# Altium schematic sheet Controller_Board_Interface.SchDoc: Title
size B; Organization: Midnight Sun Solar Rayce Car Team; Address1: University of Waterloo; Address2: 200 University Ave W; Address3: Waterloo, ON, Canada; Address4: N2L 3E9; Website: www.uwmidsun.com; ProjectName: ProjectName
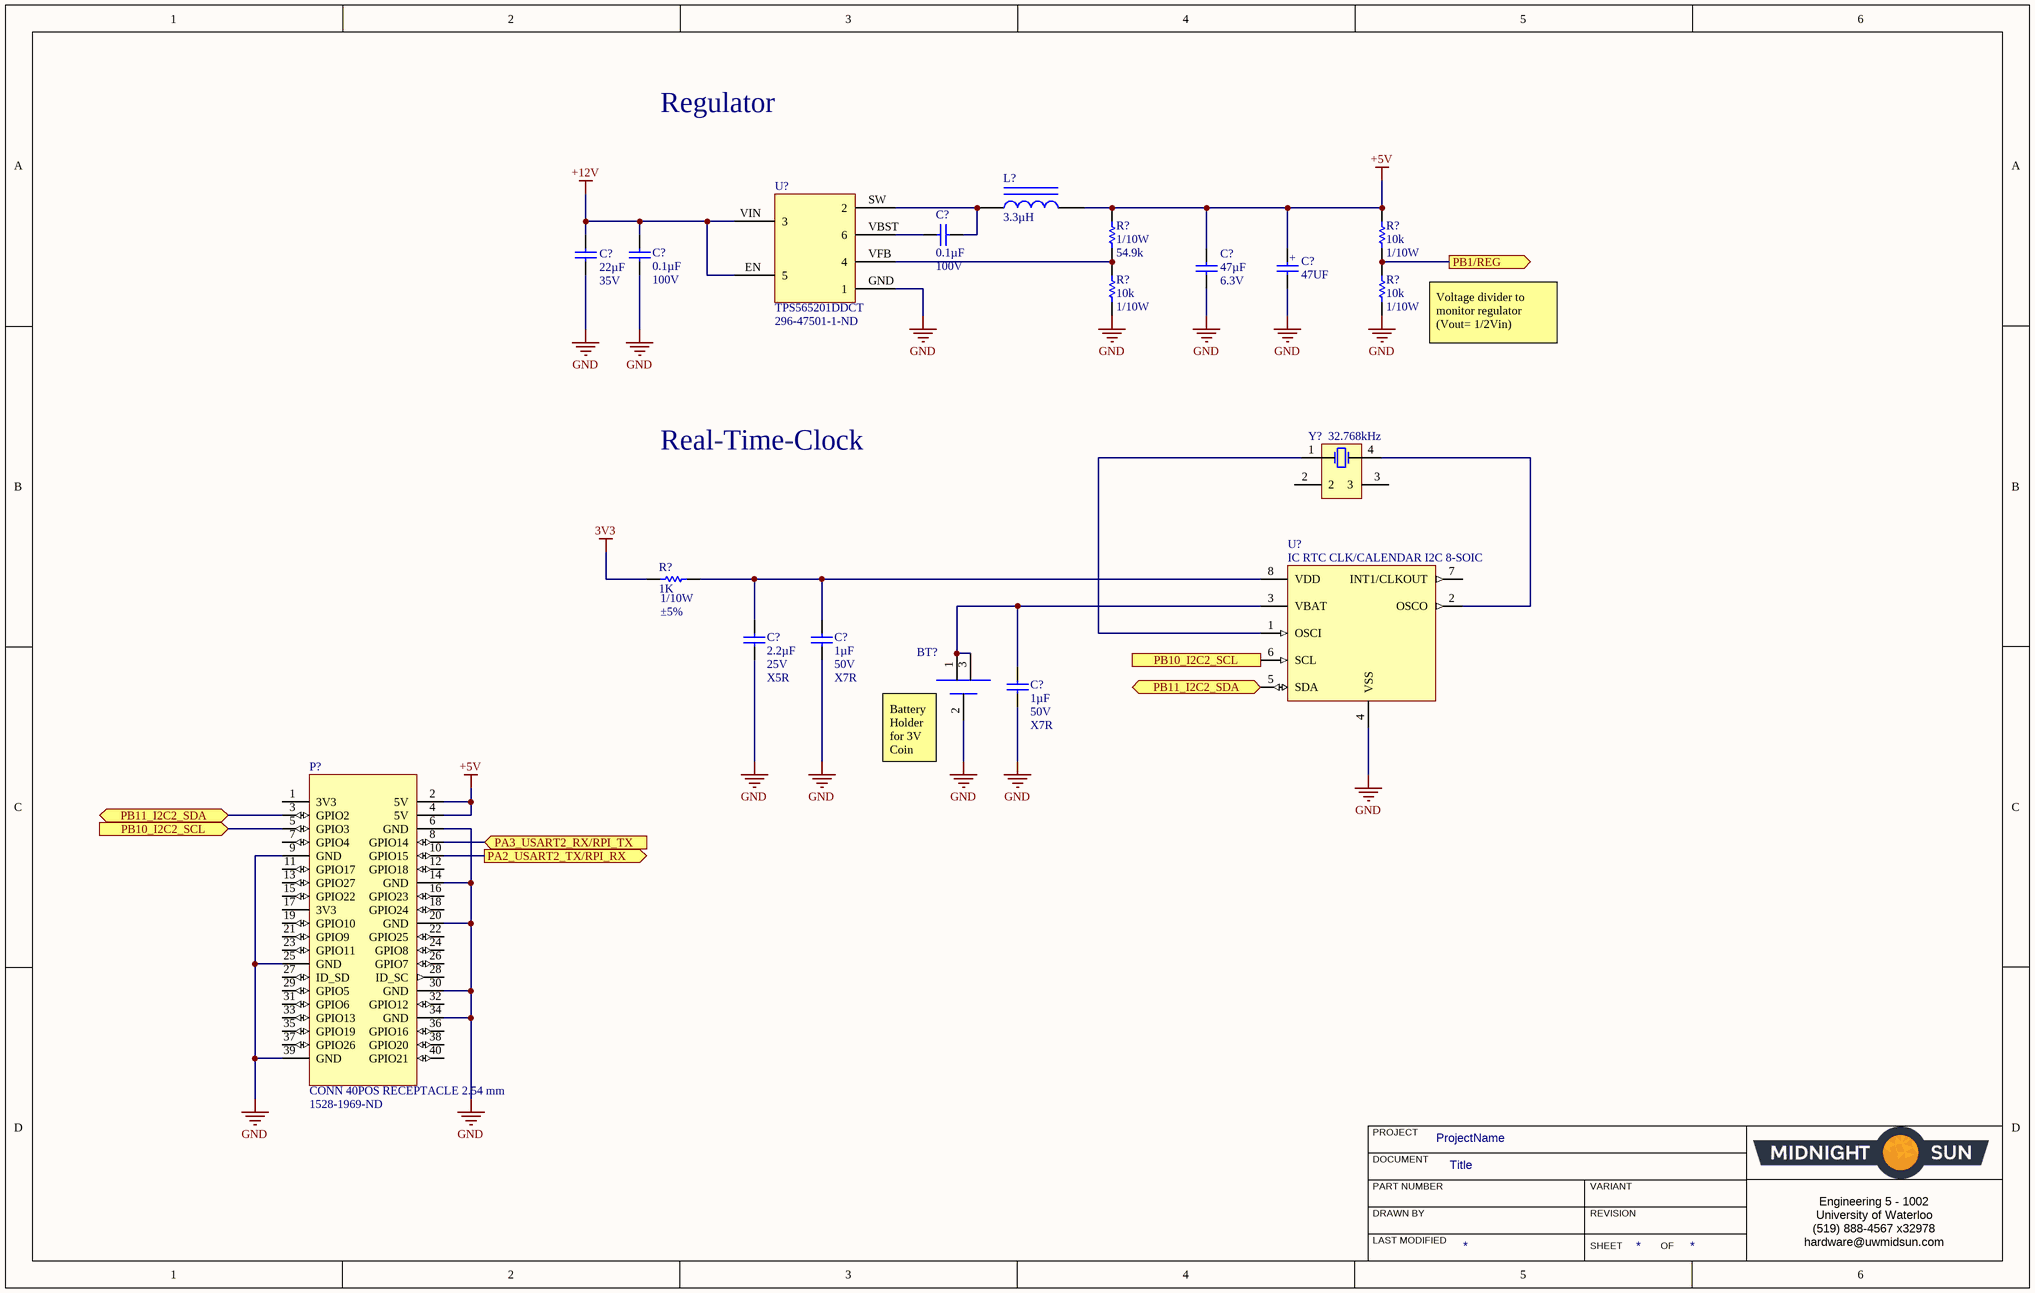
[diagram p0: Controller_Board_Interface.SchDoc]

## Parts
(Parts that share a designator on the sheet are numbered #1, #2 ... from top to bottom, then left to right.)
BT?  HOLDER BATTERY COIN 12MM DIA  [HOLDER COIN CELL 1220 3V]  (value not drawn)
C?#1  CAP CER 22UF 35V X5R 0805  [CAP, 0805]  (value not drawn)
C?#2  Capacitance: 0.1µF  Voltage: 100V  [CAP, 0805]  (hidden comment: CAP CER 0.1UF 100V 10% X7R 0805)
C?#3  Capacitance: 0.1µF  Voltage: 100V  [CAP, 0805]  (hidden comment: CAP CER 0.1UF 100V 10% X7R 0805)
C?#4  CAP CER 47UF 6.3V X7R 1210  [1210]  (value not drawn)
C?#5  47UF  [CAP ALUM 6.3MM RADIAL SMD]
C?#6  Capacitance: 2.2µF  Voltage: 25V  Temperature Coefficient: X5R  [CAP, 0603]  (hidden comment: CAP CER 2.2UF 25V 10% X5R 0603)
C?#7  Capacitance: 1µF  Voltage: 50V  Temperature Coefficient: X7R  [CAP, 0603]  (hidden comment: CAP CER 1UF 50V 10% X7R 0603)
C?#8  Capacitance: 1µF  Voltage: 50V  Temperature Coefficient: X7R  [CAP, 0603]  (hidden comment: CAP CER 1UF 50V 10% X7R 0603)
L?  Inductance: 3.3µH  [IND 3.3UH 5.2A 20 MOHM SMD VLP8040]  (hidden comment: IND 3.3uH 5.2A 20MOHM SMD)
P?  CONN 40POS RECEPTACLE 2.54 mm  Supplier Part Number 1: 1528-1969-ND  [CONN 40POS RECEPTACLE 2.54 MM]
R?#1  Power (Watts): 1/10W  Resistance (Ohms): 54.9k  [RES, 0603]  (hidden comment: RES 54.9K OHM 1% 1/10W 0603)
R?#2  Resistance: 10k  Power: 1/10W  [RES, 0603]  (hidden comment: RES 10K OHM 1% 1/10W 0603)
R?#3  Resistance: 10k  Power: 1/10W  [RES, 0603]  (hidden comment: RES 10K OHM 1% 1/10W 0603)
R?#4  Resistance: 10k  Power: 1/10W  [RES, 0603]  (hidden comment: RES 10K OHM 1% 1/10W 0603)
R?#5  1K  Tolerance: ±5%  Power (Watts): 1/10W  [RES, 0603]
U?#1  Manufacturer Part Number: TPS565201DDCT  Supplier Part Number 1: 296-47501-1-ND  (hidden comment: IC REG BUCK 4.5V TO 17V, 5A, SYNCHRONOUS STE)
U?#2  IC RTC CLK/CALENDAR I2C 8-SOIC  [SOIC8]
Y?  Frequency: 32.768kHz  [4-SOJ]  (hidden comment: CRYSTAL 32.7680KHZ 12.5PF SMD)

## Ports
PA2_USART2_TX/RPI_RX (out), PA3_USART2_RX/RPI_TX (in), PB1/REG (out), PB10_I2C2_SCL (in), PB11_I2C2_SDA (bidir)

## Nets
3V3: R?#5.1
+5V: C?#4.1 C?#5.1 L?.2 P?.2(5V) P?.4(5V) R?#1.1 R?#2.1
+12V: C?#1.1 C?#2.1 U?#1.EN(5) U?#1.VIN(3)
GND: BT?.2(negative) C?#1.2 C?#2.2 C?#4.2 C?#5.2 C?#6.2 C?#7.2 C?#8.2 P?.6(GND) P?.9(GND) P?.14(GND) P?.20(GND) P?.25(GND) P?.30(GND) P?.34(GND) P?.39(GND) R?#3.2 R?#4.2 U?#1.GND(1) U?#2.4(VSS)
PA2_USART2_TX/RPI_RX: P?.10(GPIO15) ; port PA2_USART2_TX/RPI_RX
PA3_USART2_RX/RPI_TX: P?.8(GPIO14) ; port PA3_USART2_RX/RPI_TX
PB1/REG: R?#2.2 R?#4.1 ; port PB1/REG
PB10_I2C2_SCL: P?.5(GPIO3) U?#2.6(SCL) ; port PB10_I2C2_SCL
PB11_I2C2_SDA: P?.3(GPIO2) U?#2.5(SDA) ; port PB11_I2C2_SDA
NetBT?_1: BT?.1(positive_1) BT?.3(positive_2) C?#8.1 U?#2.3(VBAT)
NetC?#3_1: C?#3.1 U?#1.VBST(6)
NetC?#3_2: C?#3.2 L?.1 U?#1.SW(2)
NetC?#6_1: C?#6.1 C?#7.1 R?#5.2 U?#2.8(VDD)
NetR?#1_2: R?#1.2 R?#3.1 U?#1.VFB(4)
NetU?#2_1: U?#2.1(OSCI) Y?.1
NetU?#2_2: U?#2.2(OSCO) Y?.4

Not connected (* = marked no-connect by the designer): P? 1(3V3) 7(GPIO4) 11(GPIO17) 12(GPIO18) 13(GPIO27) 15(GPIO22) 16(GPIO23) 17(3V3) 18(GPIO24) 19(GPIO10) 21(GPIO9) 22(GPIO25) 23(GPIO11) 24(GPIO8) 26(GPIO7) 27(ID_SD) 28(ID_SC) 29(GPIO5) 31(GPIO6) 32(GPIO12) 33(GPIO13) 35(GPIO19) 36(GPIO16) 37(GPIO26) 38(GPIO20) 40(GPIO21); U?#2 7(INT1/CLKOUT); Y? 2 3

## Notes on the sheet
- Regulator
- (near R?#4) Voltage divider to monitor regulator (Vout= 1/2Vin)
- Real-Time-Clock
- (near BT?) Battery Holder for 3V Coin Cell
- PROJECT
- DOCUMENT
- DRAWN BY
- LAST MODIFIED
- PART NUMBER
- REVISION
- SHEET
- VARIANT
- OF
- Engineering 5 - 1002
  University of Waterloo
  (519) 888-4567 x32978
  hardware@uwmidsun.com
- (in symbol CAP ALUM 47UF 20% 35V SMD) +
- (in symbol CAP CER 22UF 35V X5R 0805) 22µF
- (in symbol CAP CER 47UF 6.3V X7R 1210) 47µF

## Library data of the parts
BT? = HOLDER BATTERY COIN 12MM DIA: Coin cell holder smd; Manufacturer: Keystone Electronics; Manufacturer Part Number: 3000; Body Material: Bronze; Number of Batteries: 1; Supplier 1: Digi-Key; Stock 1: 17093; Pricing 1: 1=0.58, 10=0.545, 50=0.4356, 100=0.4175, 250=0.38116, 500=0.363, 1000=0.30495, 2500=0.27225, 5000=0.26318 (USD); Mount: Surface Mount,PCB; Contact Material: Bronze,Nickel; Material: Bronze; Contact Plating: Nickel; Package Quantity: 100; Packaging: Bulk; Termination: SMD/SMT; Number of Cells: 1; Diameter: 12mm; Height: 3.17mm; REACH SVHC: No SVHC; Lead Free: Lead Free; ComponentLink1URL: https://datasheet.ciiva.com/3/3000-3953.pdf; ComponentLink1Description: https://datasheet.ciiva.com/3/3000-3953.pdf; ComponentLink2URL: https://datasheet.ciiva.com/11714/0900766b8002ef78-11714721.pdf; ComponentLink2Description: https://datasheet.ciiva.com/11714/0900766b8002ef78-11714721.pdf; ComponentLink3URL: https://datasheet.ciiva.com/20221/18-3570e-20221596.pdf; ComponentLink3Description: https://datasheet.ciiva.com/20221/18-3570e-20221596.pdf; ComponentLink4URL: https://datasheet.ciiva.com/1391/1718262-1391630.pdf; ComponentLink4Description: https://datasheet.ciiva.com/1391/1718262-1391630.pdf; Supplier Part Number 1: 36-3000-ND
C?#1 = CAP CER 22UF 35V X5R 0805: 22µF ±20% 35V Ceramic Capacitor X5R 0805 (2012 Metric); Manufacturer: TDK; Manufacturer Part Number: C2012X5R1V226M125AC; Supplier 1: Digi-Key; RoHS: Yes; Stock 1: 30; Pricing 1: 1 = 1.29000, 10 = 0.98100, 100 = 0.70190, 500 = 0.54338, 1000 = 0.46791 (USD); Mount: Surface Mount; Case/Package: 0805; Weight: 0.000194oz; Case Code (Metric): 2012; Case Code (Imperial): 0805; Dielectric Material: Ceramic; Min Operating Temperature: -55°C; Max Operating Temperature: 85°C; Package Quantity: 2000; Packaging: Tape and Reel; Capacitance: 22uF; Tolerance: 20%; Voltage Rating: 35V; Dielectric: X5R; Termination: SMD/SMT; Voltage Rating (DC): 35V; Length: 0.079inch; Height: 1.25mm; Width: 0.049inch; Thickness: 0.057inch; REACH SVHC: No SVHC; Lead Free: Lead Free; ComponentLink1URL: https://product.tdk.com/info/en/catalog/spec/mlccspec_commercial_general_midvoltage_en.pdf; ComponentLink1Description: https://product.tdk.com/info/en/catalog/spec/mlccspec_commercial_general_midvoltage_en.pdf
C?#2 C?#3 = CAP CER 0.1UF 100V 10% X7R 0805: 0.1µF ±10% 100V Ceramic Capacitor X7R 0805 (2012 Metric); Manufacturer 1: Murata Electronics North America; Manufacturer Part Number 1: GCM21BR72A104KA37L; Supplier 1: Digi-Key; Supplier Part Number 1: 490-4789-1-ND; Packaging: Cut Tape (CT); Part Status: Active; Operating Temperature: -55°C ~ 125°C; Ratings: AEC-Q200; Mounting Type: Surface Mount, MLCC; Package / Case: 0805 (2012 Metric); Size / Dimension: 0.079" L x 0.049" W (2.00mm x 1.25mm); Height - Seated (Max): -; Thickness (Max): 0.055" (1.40mm); Lead Spacing: -; Lead Style: -; ComponentLink1URL: http://www.murata.com/~/media/webrenewal/support/library/catalog/products/capacitor/mlcc/c03e.ashx; ComponentLink1Description: http://www.murata.com/~/media/webrenewal/support/library/catalog/products/capacitor/mlcc/c03e.ashx; Tolerance: ±10%; Temperature Coefficient: X7R
C?#4 = CAP CER 47UF 6.3V X7R 1210: 47µF ±10% 6.3V Ceramic Capacitor X7R 1210 (3225 Metric); Manufacturer: Murata; Manufacturer Part Number: GCJ32ER70J476KE01L; Supplier 1: Digi-Key; RoHS: Yes; Stock 1: 191399; Pricing 1: 1 = 1.53000, 10 = 1.21200, 100 = 0.90890, 500 = 0.68670 (USD); Mount: Surface Mount; Case/Package: 1210; Weight: 0.00388oz; Case Code (Metric): 3225; Case Code (Imperial): 1210; Min Operating Temperature: -55°C; Max Operating Temperature: 125°C; Capacitance: 47uF; Packaging: Tape and Reel; Voltage Rating: 6.3V; Tolerance: 10%; Dielectric: X7R; Termination: SMD/SMT; Voltage Rating (DC): 6.3V; Package Quantity: 1000; Features: Soft Termination; Length: 0.126inch; Height: 2.5mm; Width: 0.098inch; Thickness: 0.11inch; Ratings: AEC-Q200; Lead Free: Lead Free; Supplier Part Number 1: 490-10559-1-ND
C?#5 = CAP ALUM 47UF 20% 35V SMD: 47µF 35V Aluminum Electrolytic Capacitors Radial, Can - SMD 1000 Hrs @ 85°C; Manufacturer: Panasonic; Manufacturer Part Number: EEE-1VA470WP; Tolerance: 20%; Ripple Current: 70mA; Life (Hours): 1000Hour; Supplier 1: Digi-Key; Stock 1: 2820; Pricing 1: 1=0.38, 10=0.263, 100=0.1579, 500=0.11846 (USD); Mount: Surface Mount,PCB; Case/Package: Radial; Contact Plating: Tin; Min Operating Temperature: -40°C; Max Operating Temperature: 85°C; Capacitance: 47uF; Voltage Rating (DC): 35V; Voltage Rating: 35V; Packaging: Tape and Reel; Package Quantity: 1; Ripple Current (AC): 70mA; Termination: SMD/SMT; Diameter: 6.3mm; Length: 5.5mm; Height: 5.4mm; Height - Seated (Max): 0.213inch; Radiation Hardening: No; REACH SVHC: Unknown; Lead Free: Lead Free; ComponentLink1URL: https://datasheet.ciiva.com/2983/aba0000ce2-2983926.pdf; ComponentLink1Description: https://datasheet.ciiva.com/2983/aba0000ce2-2983926.pdf; ComponentLink2URL: https://datasheet.ciiva.com/2983/aba0000ce2-2983927.pdf; ComponentLink2Description: https://datasheet.ciiva.com/2983/aba0000ce2-2983927.pdf; ComponentLink3URL: https://datasheet.ciiva.com/14598/70255710-14598937.pdf; ComponentLink3Description: https://datasheet.ciiva.com/14598/70255710-14598937.pdf; ComponentLink4URL: https://datasheet.ciiva.com/15165/getdatasheetpartid-86239-15165868.pdf; ComponentLink4Description: https://datasheet.ciiva.com/15165/getdatasheetpartid-86239-15165868.pdf; ComponentLink5URL: https://datasheet.ciiva.com/16507/aba0000ce2-16507965.pdf; ComponentLink5Description: https://datasheet.ciiva.com/16507/aba0000ce2-16507965.pdf; ComponentLink6URL: https://datasheet.ciiva.com/30206/11aba0000ce2-30206253.pdf; ComponentLink6Description: https://datasheet.ciiva.com/30206/11aba0000ce2-30206253.pdf; Supplier Part Number 1: PCE3961CT-ND
C?#6 = CAP CER 2.2UF 25V 10% X5R 0603: 2.2µF ±10% 25V Ceramic Capacitor X5R 0603 (1608 Metric); Manufacturer 1: Murata Electronics North America; Manufacturer Part Number 1: GRM188R61E225KA12D; Supplier 1: Digi-Key; Supplier Part Number 1: 490-10731-1-ND; Packaging: Cut Tape (CT); Part Status: Active; Operating Temperature: -55°C ~ 85°C; Ratings: -; Mounting Type: Surface Mount, MLCC; Package / Case: 0603 (1608 Metric); Size / Dimension: 0.063" L x 0.031" W (1.60mm x 0.80mm); Height - Seated (Max): -; Thickness (Max): 0.035" (0.90mm); Lead Spacing: -; Lead Style: -; ComponentLink1URL: http://www.murata.com/~/media/webrenewal/support/library/catalog/products/capacitor/mlcc/c02e.ashx; ComponentLink1Description: http://www.murata.com/~/media/webrenewal/support/library/catalog/products/capacitor/mlcc/c02e.ashx; Tolerance: ±10%
C?#7 C?#8 = CAP CER 1UF 50V 10% X7R 0603: 1µF ±10% 50V Ceramic Capacitor X7R 0603 (1608 Metric); Manufacturer 1: Taiyo Yuden; Manufacturer Part Number 1: UMK107AB7105KA-T; Supplier 1: Digi-Key; Supplier Part Number 1: 587-3247-1-ND; Packaging: Cut Tape (CT); Part Status: Active; Operating Temperature: -55°C ~ 125°C; Ratings: -; Mounting Type: Surface Mount, MLCC; Package / Case: 0603 (1608 Metric); Size / Dimension: 0.063" L x 0.031" W (1.60mm x 0.80mm); Height - Seated (Max): -; Thickness (Max): 0.037" (0.95mm); Lead Spacing: -; Lead Style: -; ComponentLink1URL: http://www.yuden.co.jp/productdata/catalog/en/mlcc_all_e.pdf; ComponentLink1Description: http://www.yuden.co.jp/productdata/catalog/en/mlcc_all_e.pdf; Tolerance: ±10%
L? = IND 3.3uH 5.2A 20MOHM SMD: 3.3µH Shielded Wirewound Inductor 5.2A 20 mOhm Max Nonstandard; Manufacturer: TDK Corporation; Manufacturer Part Number: VLS201612CX-3R3M; Material - Core: Ferrite; Tolerance: ±20%; Current Rating: 1.37A; Current - Saturation: 1.04A; DC Resistance (DCR): 170 mOhm Max; Frequency - Test: 1MHz; Inductance Tolerance: 30%; Test Frequency: 100kHz; RoHS: RoHS Compliant; Category: Inductors, Coils, Chokes; Packaging: Cut Tape (CT); Type: Wirewound; Shielding: Shielded; Q @ Freq: -; Frequency - Self Resonant: -; Operating Temperature: -40°C ~ 105°C; Mounting Type: Surface Mount; Package / Case: Nonstandard; Size / Dimension: 0.079" L x 0.063" W (2.00mm x 1.60mm); Height - Seated (Max): 0.047" (1.20mm); Supplier Device Package: 2016; ComponentLink1URL: http://product.tdk.com/en/catalog/datasheets/inductor_commercial_power_vls-cx_en.pdf; ComponentLink1Description: http://product.tdk.com/en/catalog/datasheets/inductor_commercial_power_vls-cx_en.pdf; Supplier 1: Digi-Key; Stock 1: 8114; Pricing 1: 1 = 0.60000, 10 = 0.52700, 100 = 0.37660, 500 = 0.31636 (USD); Mount: Surface Mount; Case/Package: Nonstandard; Core Material: Ferrite; Min Operating Temperature: -40°C; Max Operating Temperature: 105°C; Package Quantity: 1; Saturation Current: 5.2A; Max DC Current: 5.2A; Termination: SMD/SMT; Composition: Wirewound; RMS Current (Irms): 5.2A; Military Standard: Not; Length: 0.315inch; Height: 4mm; Width: 8mm; Depth: 8.7mm; REACH SVHC: No SVHC; Lead Free: Lead Free; ComponentLink2URL: http://www.mouser.com/ds/2/400/nductor_commercial_power_vlp8040_en-952627.pdf; ComponentLink2Description: http://www.mouser.com/ds/2/400/nductor_commercial_power_vlp8040_en-952627.pdf; Supplier Part Number 1: 445-6581-1-ND
P? = CONN 40POS RECEPTACLE 2.54 mm: GPIO HEADER FOR RASPBERRYPI A+/B; Manufacturer: Adafruit Industries; Manufacturer Part Number: 1992; Supplier 1: Digi-Key; Stock 1: 175; Pricing 1: 1=2.95 (USD); ComponentLink1Description: gpio header raspberry pi; ComponentLink1URL: https://www.digikey.ca/product-detail/en/adafruit-industries-llc/1992/1528-1969-ND/6827092
R?#1 = RES 54.9K OHM 1% 1/10W 0603: 54.9k Ohm ±1% 0.1W, 1/10W Chip Resistor 0603 (1608 Metric) Automotive AEC-Q200 Thick Film; Manufacturer: Panasonic Electronic Components; Manufacturer Part Number: ERJ-3EKF5492V; Temperature Coefficient: ±100ppm/°C; Supplier 1: Digi-Key; RoHS: RoHS Compliant; Category: Resistors; Stock 1: 74038; Pricing 1: 1=0.16, 10=0.031, 100=0.0127, 1000=0.00567, 2500=0.00492 (CAD); Packaging: Cut Tape (CT); Part Status: Active; Composition: Thick Film; Features: Automotive AEC-Q200; Operating Temperature: -55°C ~ 155°C; Package / Case: 0603 (1608 Metric); Supplier Device Package: 0603; Size / Dimension: 0.063" L x 0.031" W (1.60mm x 0.80mm); Height - Seated (Max): 0.022" (0.55mm); Failure Rate: -; ComponentLink1URL: https://industrial.panasonic.com/cdbs/www-data/pdf/RDA0000/AOA0000C298.pdf; ComponentLink1Description: https://industrial.panasonic.com/cdbs/www-data/pdf/RDA0000/AOA0000C298.pdf; Supplier Part Number 1: P54.9KHCT-ND; Tolerance: ±1%
R?#2-R?#4 = RES 10K OHM 1% 1/10W 0603: RES SMD 10K OHM 1% 1/10W 0603; Manufacturer 1: Yageo; Manufacturer Part Number 1: RC0603FR-0710KL; Temperature Coefficient: ±100ppm/°C; Supplier 1: Digi-Key; Supplier Part Number 1: 311-10.0KHRCT-ND; Packaging: Cut Tape (CT); Part Status: Active; Composition: Thick Film; Operating Temperature: -55°C ~ 155°C; Package / Case: 0603 (1608 Metric); Supplier Device Package: 0603; Size / Dimension: 0.063" L x 0.031" W (1.60mm x 0.80mm); Height - Seated (Max): 0.022" (0.55mm); Failure Rate: -; ComponentLink1URL: http://www.yageo.com/documents/recent/PYu-RC_Group_51_RoHS_L_7.pdf; ComponentLink1Description: http://www.yageo.com/documents/recent/PYu-RC_Group_51_RoHS_L_7.pdf; Tolerance: ±1%
R?#5 = RES 1K OHM 5% 1/10W 0603: 1k Ohm ±5% 0.1W, 1/10W Chip Resistor 0603 (1608 Metric); Manufacturer: Yageo; Manufacturer Part Number: RC0603JR-071KL; Temperature Coefficient: ±100ppm/°C; Supplier 1: Digi-Key; Supplier Part Number 1: 311-1.0KGRCT-ND; RoHS: RoHS Compliant; Category: Resistors; Stock 1: 4415240; Pricing 1: 1=0.15, 10=0.017, 100=0.0071, 1000=0.0032, 2500=0.00278 (CAD); Packaging: Cut Tape (CT); Part Status: Active; Resistance (Ohms): 1k; Composition: Thick Film; Features: Moisture Resistant; Operating Temperature: -55°C ~ 155°C; Package / Case: 0603 (1608 Metric); Supplier Device Package: 0603; Size / Dimension: 0.063" L x 0.031" W (1.60mm x 0.80mm); Height - Seated (Max): 0.022" (0.55mm); Failure Rate: -; ComponentLink1URL: http://www.yageo.com/documents/recent/PYu-RC_Group_51_RoHS_L_7.pdf; ComponentLink1Description: http://www.yageo.com/documents/recent/PYu-RC_Group_51_RoHS_L_7.pdf
U?#1 = IC REG BUCK 4.5V TO 17V, 5A, SYNCHRONOUS STE: Buck Switching Regulator IC Positive Adjustable 0.6V 1 Output 5A SOT-23-6 Thin, TSOT-23-6; Manufacturer: Texas Instruments; Supplier 1: Digi-Key; Stock 1: 2226; Pricing 1: 1 = 2.46000, 10 = 2.21100, 100 = 1.77710 (USD); Min Operating Temperature: -40°C; Max Operating Temperature: 125°C
U?#2 = IC RTC CLK/CALENDAR I2C 8-SOIC: Real Time Clock (RTC) IC Clock/Calendar I²C, 2-Wire Serial 8-SOIC (0.154", 3.90mm Width); Manufacturer: NXP Semiconductors; Manufacturer Part Number: PCF8523T/1,118; Min Supply Voltage: 1.2V; Max Supply Voltage: 5.5V; Time Format: HH:MM:SS; Supplier 1: Digi-Key; Stock 1: 18252; Pricing 1: 1=1.3, 10=1.16, 100=0.9045, 500=0.74718, 1000=0.58988 (USD); Mount: Surface Mount; Case/Package: SO; Number of Pins: 8; Contact Plating: Gold; Min Operating Temperature: -40°C; Max Operating Temperature: 85°C; Packaging: Tape and Reel; Interface: I2C; Package Quantity: 2500; Logic Function: Clock; Radiation Hardening: No; REACH SVHC: No SVHC; Lead Free: Lead Free; ComponentLink1URL: https://datasheet.ciiva.com/15152/getdatasheetpartid-445247-15152839.pdf; ComponentLink1Description: https://datasheet.ciiva.com/15152/getdatasheetpartid-445247-15152839.pdf; ComponentLink2URL: https://datasheet.ciiva.com/1238/pcf8523-1238780.pdf; ComponentLink2Description: https://datasheet.ciiva.com/1238/pcf8523-1238780.pdf; ComponentLink3URL: https://datasheet.ciiva.com/1238/pcf8523-1238781.pdf; ComponentLink3Description: https://datasheet.ciiva.com/1238/pcf8523-1238781.pdf; ComponentLink4URL: https://datasheet.ciiva.com/16286/pcf8523-16286477.pdf; ComponentLink4Description: https://datasheet.ciiva.com/16286/pcf8523-16286477.pdf; ComponentLink5URL: https://datasheet.ciiva.com/1238/pcf8523-1238782.pdf; ComponentLink5Description: https://datasheet.ciiva.com/1238/pcf8523-1238782.pdf; Supplier Part Number 1: 568-5306-1-ND
Y? = CRYSTAL 32.7680KHZ 12.5PF SMD: 32.768kHz ±20ppm Crystal 12.5pF 50 kOhms 4-SOJ, 5.50mm pitch; Manufacturer: ECS International; Manufacturer Part Number: ECS-.327-12.5-17X-TR; ESR (Equivalent Series Resistance): 50kR; Supplier 1: Digi-Key; Stock 1: 67622; Pricing 1: 1=0.56, 10=0.468, 50=0.4208, 100=0.374, 500=0.3553, 1000=0.2992 (USD); Mount: Surface Mount; Min Operating Temperature: -40°C; Max Operating Temperature: 85°C; Package Quantity: 1; Frequency Tolerance: 20ppm; Load Capacitance: 12.5pF; Packaging: Tape and Reel; Tolerance: 20ppm; Termination: SMD/SMT; Length: 0.315inch; Height: 0.098inch; Width: 0.15inch; Lead Free: Lead Free; ComponentLink1URL: https://datasheet.ciiva.com/852/ecx-306x-852775.pdf; ComponentLink1Description: https://datasheet.ciiva.com/852/ecx-306x-852775.pdf; ComponentLink2URL: https://datasheet.ciiva.com/852/ecx-306x-852776.pdf; ComponentLink2Description: https://datasheet.ciiva.com/852/ecx-306x-852776.pdf; ComponentLink3URL: https://datasheet.ciiva.com/852/ecx-306x-852777.pdf; ComponentLink3Description: https://datasheet.ciiva.com/852/ecx-306x-852777.pdf; Supplier Part Number 1: XC1195CT-ND